# EAGLE design as5600_tiny_3v3 (EAGLE 9.6.2)
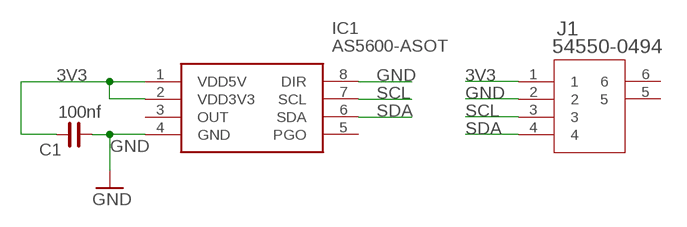
[diagram p0: schematic, sheet 1]

## Parts
C1  100nf  C_0603  [C0603]
IC1  AS5600-ASOT  [SOIC127P600X175-8N]
J1  54550-0494  [CON4_1X4_DRB2_MOL]

## Nets
3V3: C1.2 IC1.1(VDD5V) IC1.2(VDD3V3) J1.1
GND: C1.1 IC1.4(GND) IC1.8(DIR) J1.2
SCL: IC1.7(SCL) J1.3
SDA: IC1.6(SDA) J1.4
Unconnected: IC1.3(OUT) IC1.5(PGO) J1.5 J1.6

## Library data of the parts
C1 = rc-master-smd:C_: NON-POLARIZED CAP
IC1 = AS5600-ASOT:AS5600-ASOT: Board Mount Hall Effect / Magnetic Sensors AS5600 Magnetic Sensor 12-Bit Source: Datasheet <http://www.ams.com/eng/content/download/639463/1698857/325295>; DESCRIPTION: Board Mount Hall Effect / Magnetic Sensors AS5600 Magnetic Sensor 12-Bit; HEIGHT: 1.75mm; MANUFACTURER_NAME: ams; MANUFACTURER_PART_NUMBER: AS5600-ASOT; MOUSER_PART_NUMBER: 985-AS5600-ASOT; MOUSER_PRICE-STOCK: https://www.mouser.com/Search/Refine.aspx?Keyword=985-AS5600-ASOT
J1 = fpc_4p_0.5:54550-0494; BUILT_BY: EMA_UL_Team; MANUFACTURER_PART_NUMBER: 54550-0494; SOURCELIBRARY: Molex_2010-01-01; VENDOR: Molex Connector Corporation

## Board
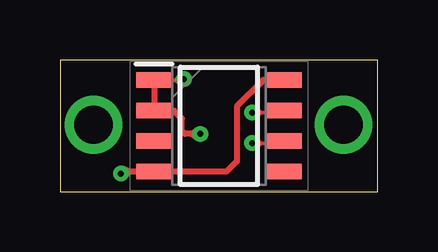
[diagram p1: board, top side]
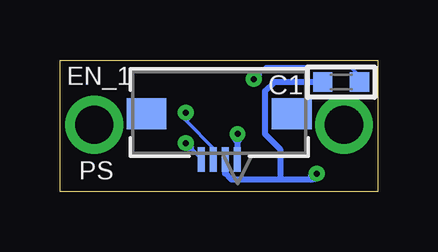
[diagram p2: board, bottom side, seen from below]

Size 13.24 x 5.49 mm. Coordinates in mm from the lower left corner, seen from the top.
Outline: 0,0 13.24,0 13.24,5.49 0,5.49 0,0
Copper layers (1*16): Top 0.035mm / dielectric 1.5mm / Bottom 0.035mm
Design rules "default *": minimum track width 6mil, minimum drill 0.35mm, track to track 6mil, track to pad 6mil, pad to pad 6mil, via to via 6mil, smd to smd 6mil, copper to edge 6mil, drill to drill 6mil, minimum pad ring 10mil, minimum via ring 8mil, stop-mask expansion 4mil, vias tented up to drill 10mil, thermal gap 10mil

### Footprints (pad centres in the part's own frame; a part is rotated, then mirrored left to right if it is on the bottom)
C0603 = smd 0.8 x 0.8: 1 -0.762,0; 2 0.762,0
SOIC127P600X175-8N = smd 1.5 x 0.65: 1 -2.7,1.905; 2 -2.7,0.635; 3 -2.7,-0.635; 4 -2.7,-1.905; 5 2.7,-1.905; 6 2.7,-0.635; 7 2.7,0.635; 8 2.7,1.905
CON4_1X4_DRB2_MOL = smd 0.305 x 1.016: 1 0.75,-1.702; 2 0.25,-1.702; 3 -0.25,-1.702; 4 -0.75,-1.702 | smd 1.65 x 1.3: 5 -3.023,0.203; 6 3.023,0.203

### Placement (x,y rotation side)
C1  1.52,4.57 0 bottom
IC1  6.62,2.75 0 top
J1  6.6,3.05 0 bottom

### Tracks (layer width: path | path; a pad name or v marks a point on that pad's centre or on a via)
3V3  (via drill 0.25)
  Top 0.152: v5.17,4.7 5.12,4.65 4.79,4.65 | 4.79,4.65 IC1.1 | 4.79,4.65 5.02,4.49 v5.17,4.7 | 4.79,4.65 4.97,4.86 v5.17,4.7
  Top 0.254: IC1.1 IC1.2 4.75,3.38 5.08,3.05 5.08,2.54 5.21,2.41 5.47,2.41 | v5.84,2.41 5.47,2.41 | 5.47,2.41 5.73,2.24 v5.84,2.41 | 5.47,2.41 5.73,2.58 v5.84,2.41
  Bottom 0.152: v5.17,4.7 4.9,4.96 | 4.9,4.96 4.66,5.21 1.14,5.21 0.76,4.83 C1.2 | 4.9,4.96 4.91,4.69 v5.17,4.7 | 4.9,4.96 5.18,4.95 v5.17,4.7
  Bottom 0.254: J1.1 5.84,2.04 | 5.84,2.04 v5.84,2.41 | 5.84,2.04 6.01,2.31 v5.84,2.41 | 5.84,2.04 5.67,2.31 v5.84,2.41
GND  (via drill 0.25)
  Top 0.254: 2.91,0.84 IC1.4 6.94,0.84 7.37,1.27 7.37,3.56 8.46,4.65 IC1.8 | 2.91,0.84 2.62,0.84 v2.54,0.76 | 2.91,0.84 2.61,0.95 v2.54,0.76 | 2.91,0.84 2.68,0.62 v2.54,0.76
  Bottom 0.254: v2.54,0.76 2.79,0.51 2.82,0.51 | 2.82,0.51 4.06,0.51 | 4.06,0.51 6.1,0.51 6.35,0.77 J1.2 | C1.1 4.32,4.57 4.7,4.19 4.7,2.41 4.06,1.78 4.06,0.51 | 2.82,0.51 2.73,0.81 v2.54,0.76 | 2.82,0.51 2.5,0.56 v2.54,0.76
N$2  (via drill 1.6)
  other vias: 11.81,2.79
N$3  (via drill 1.6)
  other vias: 1.4,2.79
SCL  (via drill 0.25)
  Top 0.152: IC1.7 9.24,3.3 8.38,3.3 | 8.38,3.3 v8,3.3 | 8.38,3.3 8.17,3.49 v8,3.3 | 8.38,3.3 8.17,3.12 v8,3.3
  Bottom 0.152: J1.3 6.85,1.82 7.95,2.93 | v8,3.3 8,2.98 7.95,2.93 | 7.95,2.93 8.16,3.11 v8,3.3 | 7.95,2.93 7.79,3.16 v8,3.3
SDA  (via drill 0.25)
  Top 0.152: IC1.6 9.24,2.03 8.38,2.03 | 8.38,2.03 v8,2.03 | 8.38,2.03 8.17,2.22 v8,2.03 | 8.38,2.03 8.17,1.84 v8,2.03
  Bottom 0.152: v8,2.03 7.74,1.77 | 7.74,1.77 7.35,1.39 J1.4 | 7.74,1.77 8.01,1.78 v8,2.03 | 7.74,1.77 7.75,2.04 v8,2.03

### Text on the board
bPlace: EN_1 | PS